# EAGLE board try1 (EAGLE 4.11)
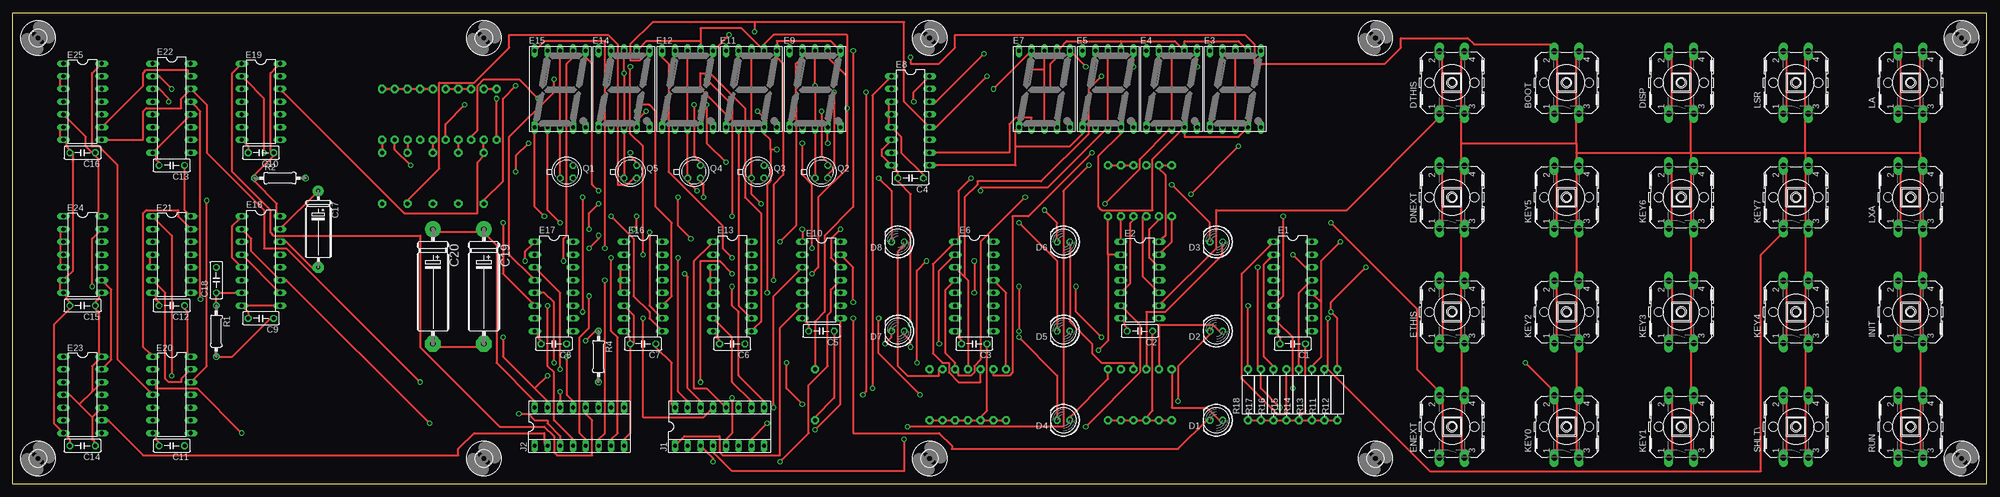
[diagram p4: board, top side]
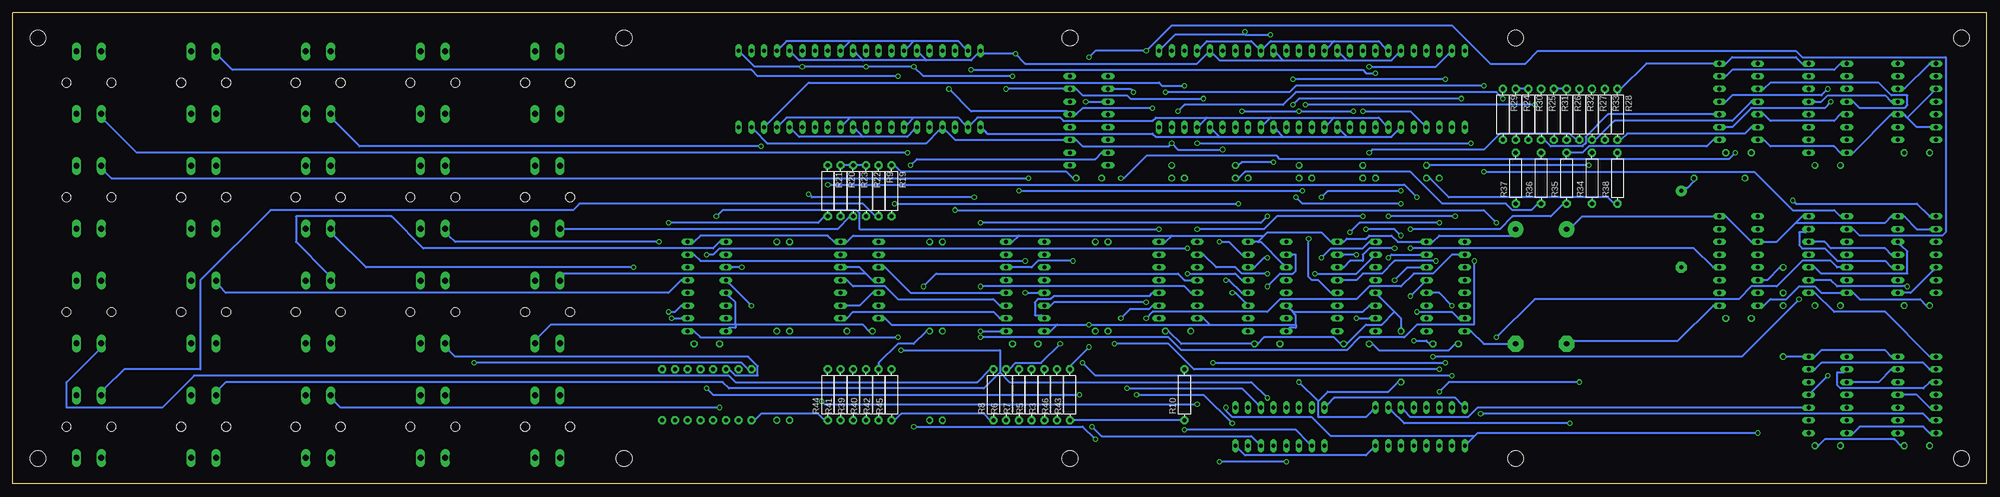
[diagram p5: board, bottom side, seen from below]

Size 393.7 x 93.98 mm. Coordinates in mm from the lower left corner, seen from the top.
Outline: 0,0 0,93.98 393.7,93.98 393.7,0 0,0
Copper layers (1*16): Top 0.035mm / dielectric 1.5mm / Bottom 0.035mm
Design rules "15mils": minimum track width 15mil, minimum drill 24mil, track to track 15mil, track to pad 10mil, pad to pad 10mil, via to via 10mil, smd to smd 10mil, copper to edge 25mil, drill to drill 10mil, minimum pad ring 10mil, minimum via ring 8mil, stop-mask expansion 0mil, vias tented up to drill 0mil, thermal gap 10mil

## Footprints (pad centres in the part's own frame; a part is rotated, then mirrored left to right if it is on the bottom)
B3F-40XX = drill 1.194 long: 1 -6.248,2.489; 2 6.248,2.489; 3 -6.248,-2.489; 4 6.248,-2.489 | hole 1.803: 0,-4.496; 0,4.496
C050-025X075 = drill 0.813 octagon: 1 -2.54,0; 2 2.54,0
E15-5 = drill 0.813 pad 2.159 round: + -7.62,0 | drill 0.813 pad 2.159 octagon: - 7.62,0
E22-6 = drill 1.016 pad 3.15 round: + -11.43,0 | drill 1.016 pad 3.15 octagon: - 11.43,0
LED5MM = drill 0.813 octagon: A -1.27,0; K 1.27,0
DIL16 = drill 0.813 long: 1 -8.89,-3.81; 2 -6.35,-3.81; 3 -3.81,-3.81; 4 -1.27,-3.81; 5 1.27,-3.81; 6 3.81,-3.81; 7 6.35,-3.81; 8 8.89,-3.81; 9 8.89,3.81; 10 6.35,3.81; 11 3.81,3.81; 12 1.27,3.81; 13 -1.27,3.81; 14 -3.81,3.81; 15 -6.35,3.81; 16 -8.89,3.81
DIL14 = drill 0.813 long: 1 -7.62,-3.81; 2 -5.08,-3.81; 3 -2.54,-3.81; 4 0,-3.81; 5 2.54,-3.81; 6 5.08,-3.81; 7 7.62,-3.81; 8 7.62,3.81; 9 5.08,3.81; 10 2.54,3.81; 11 0,3.81; 12 -2.54,3.81; 13 -5.08,3.81; 14 -7.62,3.81
HDSP-M = drill 0.813 long: 1 -5.08,-7.62; 2 -2.54,-7.62; 3 0,-7.62; 4 2.54,-7.62; 5 5.08,-7.62; 6 5.08,7.62; 7 2.54,7.62; 8 0,7.62; 9 -2.54,7.62; 10 -5.08,7.62
SOCKED-16 = drill 0.813 long: 1 -8.89,-3.81; 2 -6.35,-3.81; 3 -3.81,-3.81; 4 -1.27,-3.81; 5 1.27,-3.81; 6 3.81,-3.81; 7 6.35,-3.81; 8 8.89,-3.81; 9 8.89,3.81; 10 6.35,3.81; 11 3.81,3.81; 12 1.27,3.81; 13 -1.27,3.81; 14 -3.81,3.81; 15 -6.35,3.81; 16 -8.89,3.81
TO18 = drill 0.813 octagon: 1 -1.27,-1.27; 2 1.27,-1.27; 3 1.27,1.27
0207/10 = drill 0.813 octagon: 1 -5.08,0; 2 5.08,0
R-10 = drill 0.813 pad 1.6 octagon: 1 -5.08,0; 2 5.08,0
3,2 = hole 3.2: 0,0

## Placement (x,y rotation side)
BOOT  [B3F-40XX]  309.88,80.01 90 top
C1  0.01  [C050-025X075]  255.27,27.94 180 top
C2  0.01  [C050-025X075]  224.79,30.48 180 top
C3  0.01  [C050-025X075]  191.77,27.94 180 top
C4  0.01  [C050-025X075]  179.07,60.96 180 top
C5  0.01  [C050-025X075]  161.29,30.48 180 top
C6  0.01  [C050-025X075]  143.51,27.94 180 top
C7  0.01  [C050-025X075]  125.73,27.94 180 top
C8  0.01  [C050-025X075]  107.95,27.94 180 top
C9  0.01  [C050-025X075]  49.53,33.02 180 top
C10  0.01  [C050-025X075]  49.53,66.04 180 top
C11  0.01  [C050-025X075]  31.75,7.62 180 top
C12  0.01  [C050-025X075]  31.75,35.56 180 top
C13  0.01  [C050-025X075]  31.75,63.5 180 top
C14  0.01  [C050-025X075]  13.97,7.62 180 top
C15  0.01  [C050-025X075]  13.97,35.56 180 top
C16  0.01  [C050-025X075]  13.97,66.04 180 top
C17  1.0uf  [E15-5]  60.96,50.8 270 top
C18  82pf  [C050-025X075]  40.64,40.64 90 top
C19  6.8uf  [E22-6]  93.98,39.37 270 top
C20  6.8uf  [E22-6]  83.82,39.37 270 top
D1  MQ  [LED5MM]  240.03,12.7 180 top
D2  SR  [LED5MM]  240.03,30.48 180 top
D3  MD  [LED5MM]  240.03,48.26 180 top
D4  AC  [LED5MM]  209.55,12.7 180 top
D5  STATUS  [LED5MM]  209.55,30.48 180 top
D6  STATE  [LED5MM]  209.55,48.26 180 top
D7  BUS  [LED5MM]  176.53,30.48 180 top
D8  RUN  [LED5MM]  176.53,48.26 180 top
DISP  [B3F-40XX]  332.74,80.01 90 top
DNEXT  [B3F-40XX]  287.02,57.15 90 top
DTHIS  [B3F-40XX]  287.02,80.01 90 top
E1  74LS148N  [DIL16]  255.27,39.37 270 top
E2  74LS08N  [DIL14]  224.79,40.64 270 top
E3  HD-H101  [HDSP-M]  243.84,78.74 0 top
E4  HD-H101  [HDSP-M]  231.14,78.74 0 top
E5  HD-H101  [HDSP-M]  218.44,78.74 0 top
E6  74LS148N  [DIL16]  191.77,39.37 270 top
E7  HD-H101  [HDSP-M]  205.74,78.74 0 top
E8  7446N  [DIL16]  179.07,72.39 270 top
E9  HD-H101  [HDSP-M]  160.02,78.74 0 top
E10  74LS08N  [DIL14]  161.29,40.64 270 top
E11  HD-H101  [HDSP-M]  147.32,78.74 0 top
E12  HD-H101  [HDSP-M]  134.62,78.74 0 top
E13  7446N  [DIL16]  143.51,39.37 270 top
E14  HD-H101  [HDSP-M]  121.92,78.74 0 top
E15  HD-H101  [HDSP-M]  109.22,78.74 0 top
E16  7446N  [DIL16]  125.73,39.37 270 top
E17  74LS145N  [DIL16]  107.95,39.37 270 top
E18  74LS123N  [DIL16]  49.53,44.45 270 top
E19  7416N  [DIL14]  49.53,76.2 270 top
E20  74LS04N  [DIL14]  31.75,17.78 270 top
E21  74LS20N  [DIL14]  31.75,45.72 270 top
E22  74LS42N  [DIL16]  31.75,74.93 270 top
E23  74LS74N  [DIL14]  13.97,17.78 270 top
E24  74LS95N  [DIL14]  13.97,45.72 270 top
E25  74LS90N  [DIL14]  13.97,76.2 270 top
ENEXT  [B3F-40XX]  287.02,11.43 90 top
ETHIS  [B3F-40XX]  287.02,34.29 90 top
INIT  [B3F-40XX]  378.46,34.29 90 top
J1  [SOCKED-16]  140.97,11.43 0 top
J2  [SOCKED-16]  113.03,11.43 0 top
KEY0  [B3F-40XX]  309.88,11.43 90 top
KEY1  [B3F-40XX]  332.74,11.43 90 top
KEY2  [B3F-40XX]  309.88,34.29 90 top
KEY3  [B3F-40XX]  332.74,34.29 90 top
KEY4  [B3F-40XX]  355.6,34.29 90 top
KEY5  [B3F-40XX]  309.88,57.15 90 top
KEY6  [B3F-40XX]  332.74,57.15 90 top
KEY7  [B3F-40XX]  355.6,57.15 90 top
LA  [B3F-40XX]  378.46,80.01 90 top
LSR  [B3F-40XX]  355.6,80.01 90 top
LXA  [B3F-40XX]  378.46,57.15 90 top
Q1  2N2222A  [TO18]  110.49,62.23 0 top
Q2  2N2222A  [TO18]  161.29,62.23 0 top
Q3  2N2222A  [TO18]  148.59,62.23 0 top
Q4  2N2222A  [TO18]  135.89,62.23 0 top
Q5  2N2222A  [TO18]  123.19,62.23 0 top
R1  10K  [0207/10]  40.64,30.48 270 top
R2  6.8K  [0207/10]  53.34,60.96 0 top
R3  [R-10]  187.96,17.78 90 bottom
R4  10K  [0207/10]  116.84,25.4 270 top
R5  [R-10]  190.5,17.78 90 bottom
R6  [R-10]  195.58,17.78 90 bottom
R7  [R-10]  193.04,17.78 90 bottom
R8  [R-10]  198.12,17.78 90 bottom
R9  [R-10]  220.98,58.42 270 bottom
R10  [R-10]  160.02,17.78 90 bottom
R11  [R-10]  261.62,17.78 90 top
R12  [R-10]  264.16,17.78 90 top
R13  [R-10]  259.08,17.78 90 top
R14  [R-10]  256.54,17.78 90 top
R15  [R-10]  254,17.78 90 top
R16  [R-10]  251.46,17.78 90 top
R17  [R-10]  248.92,17.78 90 top
R18  [R-10]  246.38,17.78 90 top
R19  [R-10]  218.44,58.42 270 bottom
R20  [R-10]  228.6,58.42 270 bottom
R21  [R-10]  231.14,58.42 270 bottom
R22  [R-10]  223.52,58.42 270 bottom
R23  [R-10]  226.06,58.42 270 bottom
R24  [R-10]  93.98,73.66 270 bottom
R25  [R-10]  88.9,73.66 270 bottom
R26  [R-10]  83.82,73.66 270 bottom
R27  [R-10]  78.74,73.66 270 bottom
R28  [R-10]  73.66,73.66 270 bottom
R29  [R-10]  96.52,73.66 270 bottom
R30  [R-10]  91.44,73.66 270 bottom
R31  [R-10]  86.36,73.66 270 bottom
R32  [R-10]  81.28,73.66 270 bottom
R33  [R-10]  76.2,73.66 270 bottom
R34  [R-10]  78.74,60.96 90 bottom
R35  [R-10]  83.82,60.96 90 bottom
R36  [R-10]  88.9,60.96 90 bottom
R37  [R-10]  93.98,60.96 90 bottom
R38  [R-10]  73.66,60.96 90 bottom
R39  [R-10]  226.06,17.78 90 bottom
R40  [R-10]  223.52,17.78 90 bottom
R41  [R-10]  228.6,17.78 90 bottom
R42  [R-10]  220.98,17.78 90 bottom
R43  [R-10]  182.88,17.78 90 bottom
R44  [R-10]  231.14,17.78 90 bottom
R45  [R-10]  218.44,17.78 90 bottom
R46  [R-10]  185.42,17.78 90 bottom
RUN  [B3F-40XX]  378.46,11.43 90 top
SHLT\  [B3F-40XX]  355.6,11.43 90 top
U$1  [3,2]  5.08,5.08 0 top
U$2  [3,2]  5.08,88.9 0 top
U$3  [3,2]  388.62,88.9 0 top
U$4  [3,2]  388.62,5.08 0 top
U$5  [3,2]  93.98,88.9 0 top
U$6  [3,2]  182.88,5.08 0 top
U$7  [3,2]  93.98,5.08 0 top
U$8  [3,2]  271.78,5.08 0 top
U$9  [3,2]  271.78,88.9 0 top
U$10  [3,2]  182.88,88.9 0 top

## Tracks (layer width: path | path; a pad name or v marks a point on that pad's centre or on a via)
A  (via drill 0.61)
  Top 0.381: 220.98,88.27 210.19,88.27 208.91,87 E7.7 208.28,85.09 207.01,83.82 v207.01,78.74 | 220.98,88.27 220.98,87.63 E5.7 | 220.98,88.27 231.78,88.27 233.04,87 E4.7 233.68,87.63 233.68,88.27 244.47,88.27 245.75,87 E3.7 | 137.16,88.27 126.36,88.27 125.09,87 E14.7 | 137.16,88.27 137.16,87.63 E12.7 | 137.16,88.27 137.16,90.81 145.41,90.81 149.22,87 E11.7 149.86,87.63 151.76,89.53 166.37,89.53 166.37,81.28 | v159.38,41.91 160.66,43.18 160.66,57.15 166.37,62.87 v166.37,74.93 166.37,81.28 | 166.37,81.28 162.56,85.09 E9.7
  Bottom 0.381: v159.38,41.91 149.86,41.91 148.59,40.64 E13.13 | v166.37,74.93 180.34,74.93 181.61,73.66 E8.13 183.51,74.3 202.56,74.3 v207.01,78.74
ADDR0
  Top 0.381: J1.10 147.32,16.51 143.51,20.32 143.51,29.21 140.34,32.38 E13.7
ADDR1
  Top 0.381: J1.12 141.6,15.88 138.43,19.05 135.89,19.05 135.89,44.45 139.06,47.62 E13.1
ADDR2  (via drill 0.61)
  Top 0.381: v143.51,39.37 143.51,35.56 144.78,34.29 144.78,21.59 149.86,16.51 J1.9
  Bottom 0.381: v143.51,39.37 140.97,41.91 138.43,41.91 137.79,42.55 137.79,45.72 138.43,45.72 E13.2
B  (via drill 0.61)
  Top 0.381: v142.88,89.53 140.34,87 E12.6 | v151.76,40.64 151.76,59.69 153.67,61.59 153.67,83.82 152.4,85.09 E11.6 152.4,87.63 152.4,88.27 163.19,88.27 164.47,87 E9.6 | v214,83.19 211.46,85.72 E7.6 | v223.52,83.19 223.52,85.09 E5.6 | v236.22,83.19 236.22,85.09 E4.6 | 147.96,92.08 177.8,92.08 177.8,76.2 182.25,71.75 E8.12 184.15,71.12 v194.31,81.28 | 147.96,92.08 127.64,92.08 123.19,87.63 123.19,84.45 125.09,84.45 126.36,85.72 E14.6 | 147.96,92.08 v147.96,90.17
  Bottom 0.381: 147.96,89.53 161.93,89.53 164.47,87 E9.6 | 147.96,89.53 v142.88,89.53 | v151.76,40.64 151.13,40.64 148.59,38.1 E13.12 | E3.6 248.28,85.72 245.75,83.19 v236.22,83.19 v223.52,83.19 v214,83.19 212.09,81.28 v194.31,81.28 | v147.96,90.17 147.96,89.53
BEMA0  (via drill 0.61)
  Top 0.381: v125.73,33.02 125.73,13.34 137.79,13.34 139.06,14.61 J1.13
  Bottom 0.381: v125.73,33.02 123.19,33.02 E16.7
BEMA1  (via drill 0.61)
  Top 0.381: v132.72,45.09 132.72,18.41 134.62,16.51 J1.15
  Bottom 0.381: v132.72,45.09 130.81,46.99 124.46,46.99 123.19,48.26 E16.1
BEMA2  (via drill 0.61)
  Top 0.381: v133.99,41.91 134.62,41.27 134.62,19.05 137.16,16.51 J1.14
  Bottom 0.381: v133.99,41.91 125.73,41.91 122.56,45.09 E16.2
BOOT  (via drill 0.61)
  Top 0.381: BOOT.1 307.98,74.93 307.98,85.09 BOOT.2 306.7,87.63 291.46,87.63 290.19,88.9 276.86,88.9 276.86,87 273.69,83.82 247.65,83.82 247.65,87.63 245.75,89.53 187.96,89.53 187.96,87 184.78,83.82 179.07,83.82 v179.07,85.09 | v167.64,86.36 167.64,55.24 161.93,49.53 161.93,34.29 160.02,32.38 160.02,23.5 R10.2
  Bottom 0.381: E21.2 26.67,50.8 25.4,49.53 8.89,49.53 8.26,50.16 8.26,85.09 36.83,85.09 38.1,86.36 89.53,86.36 92.08,83.82 99.06,83.82 106.68,91.44 162.56,91.44 v167.64,86.36 177.8,86.36 v179.07,85.09
BPWR-OK  (via drill 0.61)
  Top 0.381: E18.2 46.35,50.16 47.62,48.9 47.62,46.35 52.7,41.27 E18.11 54.61,40.64 v83.19,12.06
  Bottom 0.381: v83.19,12.06 116.2,12.06 118.75,14.61 J2.10
BRUN
  Top 0.381: E19.1 45.09,83.19 43.81,81.92 43.81,62.23 51.44,54.61 51.44,50.16 52.07,49.53 81.28,49.53 81.28,27.3 97.16,11.43 106.05,11.43 107.95,9.53 107.95,6.35 108.58,5.71 115.57,5.71 115.57,12.7 114.3,13.97 J2.12
C  (via drill 0.61)
  Top 0.381: v126.36,74.3 124.46,72.39 E14.4 | v137.16,74.3 137.16,72.39 E12.4 | v150.5,38.1 150.5,59.69 151.13,60.33 151.13,66.67 | 151.13,66.67 151.13,68.58 149.86,69.85 E11.4 149.86,72.39 149.86,73.03 v148.59,74.3 | E5.4 220.98,69.85 216.53,65.41 216.53,55.24 217.17,54.61 227.33,54.61 227.33,64.77 233.04,70.48 E4.4 233.68,69.85 233.68,69.22 244.47,69.22 245.75,70.48 E3.4 | v162.56,67.94 162.56,69.85 E9.4 | v152.4,66.67 151.13,66.67
  Bottom 0.381: v126.36,74.3 v137.16,74.3 v148.59,74.3 | v150.5,38.1 149.86,38.1 147.96,36.2 E13.11 | E3.4 245.75,70.48 243.21,67.94 211.46,67.94 208.91,70.48 E7.4 207.65,70.48 205.74,68.58 184.15,68.58 E8.11 181.61,68.58 180.34,67.31 163.19,67.31 v162.56,67.94 161.29,66.67 v152.4,66.67
D
  Top 0.381: E8.10 184.15,66.04 198.75,66.04 198.75,71.75 200.03,73.03 203.2,73.03 203.2,72.39 E7.2 | E13.10 146.69,33.66 144.78,35.56 144.78,69.85 E11.2
  Bottom 0.381: 214,73.03 215.26,71.75 E5.2 | 214,73.03 205.1,73.03 203.84,71.75 E7.2 202.56,71.75 201.29,73.03 184.78,73.03 184.15,72.39 166.37,72.39 165.74,73.03 155.57,73.03 | 226.69,73.03 227.97,71.75 E4.2 | 214,73.03 226.69,73.03 | 226.69,73.03 239.4,73.03 240.66,71.75 E3.2 | 130.18,73.03 121.28,73.03 120.02,71.75 E14.2 | 130.18,73.03 131.44,71.75 E12.2 | 142.88,73.03 144.15,71.75 E11.2 | 142.88,73.03 130.18,73.03 | 155.57,73.03 156.84,71.75 E9.2 | 155.57,73.03 142.88,73.03
DISP  (via drill 0.61)
  Top 0.381: DISP.1 330.83,74.93 330.83,85.09 DISP.2 | E6.4 187.32,40.01 186.06,38.73 186.06,26.04 187.96,24.13 187.96,23.5 R3.2 188.59,22.86 188.59,21.59 191.13,21.59 191.77,22.23 191.77,23.5 193.04,24.77 193.04,48.26 v201.93,57.15 | v234.95,57.78 v244.47,67.31
  Bottom 0.381: v244.47,67.31 324.49,67.31 329.56,72.39 DISP.1 | v234.95,57.78 234.31,57.15 v201.93,57.15
DISP0  (via drill 0.61)
  Top 0.381: v114.94,37.47 114.94,31.11 113.03,29.21 113.03,10.16 114.3,8.89 J2.5
  Bottom 0.381: v114.94,37.47 112.39,40.01 E17.13
DISP1  (via drill 0.61)
  Top 0.381: v118.11,40.64 118.11,10.16 116.84,8.89 J2.6
  Bottom 0.381: v118.11,40.64 115.57,43.18 113.03,43.18 E17.14
DISP2  (via drill 0.61)
  Top 0.381: v119.38,45.09 119.38,30.48 120.65,29.21 120.65,10.16 119.38,8.89 J2.7
  Bottom 0.381: v119.38,45.09 118.75,45.72 113.03,45.72 E17.15
DISPINH  (via drill 0.61)
  Top 0.381: v106.68,35.56 106.68,23.5 107.95,22.23 107.95,12.7 111.76,8.89 J2.4
  Bottom 0.381: v106.68,35.56 109.22,38.1 110.49,38.1 E17.12
DISPLAY0  (via drill 0.61)
  Top 0.381: v178.44,11.43 209.55,11.43 209.55,58.42 v214.63,63.5
  Bottom 0.381: v178.44,11.43 176.53,9.53 146.69,9.53 145.41,8.26 J1.6 | v214.63,63.5 213.36,64.77 177.8,64.77 176.53,66.04 E8.7
DISPLAY1  (via drill 0.61)
  Top 0.381: v171.45,19.05 171.45,77.47 174.62,80.64 E8.1
  Bottom 0.381: v171.45,19.05 148.59,19.05 145.41,15.88 J1.11
DISPLAY2  (via drill 0.61)
  Top 0.381: v150.5,12.06 147.32,8.89 J1.7 | v169.54,17.78 170.18,18.41 v170.18,78.11
  Bottom 0.381: v150.5,12.06 156.21,17.78 v169.54,17.78 | v170.18,78.11 170.81,78.74 173.99,78.74 E8.2
DNEXT
  Top 0.381: DNEXT.1 285.12,52.07 285.12,62.23 DNEXT.2 | E2.10 227.97,38.73 225.43,41.27 225.43,53.34 R23.2
  Bottom 0.381: DNEXT.1 283.85,50.8 229.24,50.8 226.69,53.34 R23.2
DTHIS
  Top 0.381: DTHIS.2 285.12,85.09 285.12,74.93 DTHIS.1 283.85,72.39 266.06,54.61 240.03,54.61 240.03,46.99 229.24,36.2 E2.9 | R22.2 223.52,52.7 222.88,52.07 222.88,40.01 221.62,38.73 E2.5
  Bottom 0.381: E2.5 222.25,38.1 224.79,35.56 227.33,35.56 E2.9
E
  Top 0.381: 200.03,67.31 200.03,70.48 E7.1 | 200.03,67.31 200.03,63.5 184.15,63.5 E8.9 | 200.03,67.31 210.82,67.31 213.36,69.85 E5.1 | E13.9 147.96,31.11 149.22,32.38 149.22,53.98 146.05,57.15 146.05,74.93 139.06,81.92 137.16,81.92 137.16,78.74 142.24,73.66 142.24,72.39 E11.1
  Bottom 0.381: 224.16,69.22 215.26,69.22 214,70.48 E5.1 | 224.16,69.22 225.43,70.48 E4.1 | 224.16,69.22 236.85,69.22 238.12,70.48 E3.1 | 127.64,69.22 118.75,69.22 117.47,70.48 E14.1 | 127.64,69.22 128.91,70.48 E12.1 | 140.34,69.22 141.6,70.48 E11.1 | 140.34,69.22 127.64,69.22 | 153.03,69.22 154.31,70.48 E9.1 | 153.03,69.22 140.34,69.22 | 153.03,69.22 165.74,69.22 166.37,69.85 199.39,69.85 200.03,70.48 E7.1
ENEXT  (via drill 0.61)
  Top 0.381: E2.13 229.24,46.35 231.14,48.26 231.14,52.7 R21.2 | ENEXT.1 285.12,6.35 285.12,16.51 ENEXT.2 283.85,19.05 280.04,22.86 280.04,34.92 v262.89,52.07
  Bottom 0.381: v262.89,52.07 233.04,52.07 231.78,53.34 R21.2
ETHIS
  Top 0.381: ETHIS.1 285.12,29.21 285.12,39.37 ETHIS.2 | R20.2 228.6,52.7 226.69,50.8 226.69,45.09 227.97,43.81 E2.12
  Bottom 0.381: 223.52,41.91 224.79,43.18 227.33,43.18 E2.12 | 223.52,41.91 222.25,40.64 E2.4 | 223.52,41.91 283.85,41.91 ETHIS.2
EXTPUL\  (via drill 0.61)
  Top 0.381: v143.51,41.91 140.97,44.45 137.16,44.45 v137.16,20.32
  Bottom 0.381: 133.35,16.51 131.44,18.41 119.38,18.41 117.47,20.32 R4.2 | 133.35,16.51 133.35,13.34 123.83,13.34 122.56,14.61 J2.9 | v143.51,41.91 148.59,41.91 149.86,43.18 153.67,43.18 156.21,45.72 E10.2 | 133.35,16.51 v137.16,20.32
F  (via drill 0.61)
  Top 0.381: v195.58,78.74 202.56,85.72 E7.9 | v153.03,48.26 156.21,51.44 v156.21,76.83 156.21,83.82 157.48,85.09 E9.9
  Bottom 0.381: v195.58,78.74 184.15,78.74 E8.15 181.61,78.74 180.34,77.47 171.45,77.47 170.81,76.83 v156.21,76.83 | 214,88.27 215.26,87 E5.9 | 214,88.27 205.1,88.27 203.84,87 E7.9 | 226.69,88.27 227.97,87 E4.9 | 214,88.27 226.69,88.27 | 226.69,88.27 239.4,88.27 240.66,87 E3.9 | 130.18,88.27 121.28,88.27 120.02,87 E14.9 | 130.18,88.27 131.44,87 E12.9 | 130.18,88.27 142.88,88.27 144.15,87 E11.9 145.41,87 146.69,88.27 155.57,88.27 156.84,87 E9.9 | v153.03,48.26 151.13,48.26 148.59,45.72 E13.15
FUN\  (via drill 0.61)
  Top 0.381: E21.5 27.3,43.81 27.3,45.09 E21.4 | 104.14,19.05 97.79,25.4 v97.79,29.21 | 104.14,19.05 106.68,16.51 J2.15 | v182.25,44.45 180.34,42.55 v180.34,24.13 | 104.14,19.05 v106.68,21.59
  Bottom 0.381: v97.79,29.21 90.17,36.83 49.53,36.83 46.99,39.37 41.91,39.37 36.83,44.45 31.11,44.45 29.84,43.18 29.21,43.18 E21.5 | v182.25,44.45 189.23,44.45 190.5,43.18 194.31,43.18 E6.14 | v180.34,24.13 177.8,21.59 v106.68,21.59
G  (via drill 0.61)
  Top 0.381: v193.68,85.72 184.15,76.2 E8.14 | v143.51,45.09 141.6,46.99 141.6,51.44 130.81,62.23 130.81,83.82 129.54,85.09 E12.10
  Bottom 0.381: 211.46,84.45 212.72,85.72 E5.10 | 211.46,84.45 202.56,84.45 201.29,85.72 E7.10 200.03,85.72 v193.68,85.72 191.77,83.82 157.48,83.82 155.57,85.72 E9.10 154.31,85.72 153.03,84.45 140.34,84.45 | 224.16,84.45 225.43,85.72 E4.10 | 211.46,84.45 224.16,84.45 | 224.16,84.45 236.85,84.45 238.12,85.72 E3.10 | 127.64,84.45 118.75,84.45 117.47,85.72 E14.10 | 127.64,84.45 128.91,85.72 E12.10 | 140.34,84.45 141.6,85.72 E11.10 | 140.34,84.45 127.64,84.45 | v143.51,45.09 144.15,45.09 146.05,43.18 E13.14
GND  (via drill 0.61)
  Top 0.381: 380.37,66.04 380.37,72.39 LA.3 380.37,74.93 380.37,85.09 LA.4 | 380.37,66.04 380.37,64.77 LXA.4 380.37,62.23 380.37,52.07 LXA.3 380.37,49.53 380.37,41.91 INIT.4 380.37,39.37 380.37,29.21 INIT.3 380.37,26.67 380.37,19.05 RUN.4 380.37,16.51 380.37,6.35 RUN.3 | 357.5,66.04 357.5,72.39 LSR.3 357.5,74.93 357.5,85.09 LSR.4 | 357.5,66.04 357.5,64.77 KEY7.4 357.5,62.23 357.5,52.07 KEY7.3 357.5,49.53 357.5,41.91 KEY4.4 357.5,39.37 357.5,29.21 KEY4.3 357.5,26.67 357.5,19.05 SHLT\.4 357.5,16.51 357.5,6.35 SHLT\.3 | 334.64,66.04 334.64,72.39 DISP.3 334.64,74.93 334.64,85.09 DISP.4 | 334.64,66.04 334.64,64.77 KEY6.4 334.64,62.23 334.64,52.07 KEY6.3 334.64,49.53 334.64,41.91 KEY3.4 334.64,39.37 334.64,29.21 KEY3.3 334.64,26.67 334.64,19.05 KEY1.4 334.64,16.51 334.64,6.35 KEY1.3 | 288.93,67.94 288.93,72.39 DTHIS.3 288.93,74.93 288.93,85.09 DTHIS.4 | 288.93,67.94 288.93,64.77 DNEXT.4 288.93,62.23 288.93,52.07 DNEXT.3 288.93,49.53 288.93,41.91 ETHIS.4 288.93,39.37 288.93,29.21 ETHIS.3 288.93,26.67 288.93,19.05 ENEXT.4 288.93,16.51 288.93,6.35 ENEXT.3 | 311.79,67.94 311.79,72.39 BOOT.3 311.79,74.93 311.79,85.09 BOOT.4 | 311.79,67.94 311.79,66.04 | 311.79,66.04 311.79,64.77 KEY5.4 311.79,62.23 311.79,52.07 KEY5.3 311.79,49.53 311.79,41.91 KEY2.4 311.79,39.37 311.79,29.21 KEY2.3 311.79,26.67 311.79,19.05 KEY0.4 311.79,16.51 311.79,6.35 KEY0.3 | 288.93,67.94 311.79,67.94 | 311.79,66.04 334.64,66.04 | 334.64,66.04 357.5,66.04 | 357.5,66.04 380.37,66.04 | C14.2 11.43,8.26 11.43,8.89 10.79,9.53 E23.7 9.53,10.79 8.26,12.06 8.26,31.75 11.43,34.92 C15.2 11.43,36.2 10.79,36.83 10.79,37.47 E24.7 9.53,38.73 9.53,40.01 E24.6 10.79,41.27 12.06,42.55 12.06,66.04 C16.2 11.43,66.67 10.79,67.31 10.79,67.94 E25.7 9.53,69.22 9.53,70.48 E25.6
  Top 0.381: C11.2 29.21,8.26 28.57,8.89 28.57,9.53 E20.7 | C12.2 29.21,36.2 28.57,36.83 28.57,37.47 E21.7 | E25.3 9.53,79.38 9.53,80.64 E25.2 | E19.7 46.35,67.94 46.99,67.31 46.99,66.67 C10.2 | C13.2 29.21,64.14 28.57,64.77 28.57,65.41 E22.8 28.57,66.67 34.92,73.03 E22.12 | C8.2 105.41,28.57 104.78,29.21 104.78,29.84 E17.8 | C9.2 46.99,33.66 46.99,34.29 46.35,34.92 E18.8 46.99,35.56 52.07,35.56 E18.9 | C19.- 92.71,27.3 85.09,27.3 C20.- | J2.8 121.92,8.89 123.19,10.16 123.19,27.3 C7.2 | E16.8 122.56,29.84 123.19,29.21 123.19,28.57 C7.2 | E16.6 122.56,34.92 123.83,33.66 123.83,27.94 C7.2 | C2.2 222.25,31.11 221.62,31.75 221.62,32.38 E2.7 | E1.8 252.09,29.84 252.73,29.21 252.73,28.57 C1.2 | E8.6 174.62,67.94 173.35,66.67 173.35,65.41 174.62,64.14 E8.8 175.9,62.87 176.53,62.23 176.53,61.59 C4.2 176.53,60.33 179.07,57.78 v179.07,31.75 | C3.2 189.23,28.57 188.59,29.21 188.59,29.84 E6.8 | E10.7 158.12,32.38 158.75,31.75 158.75,31.11 C5.2 | C6.2 140.97,28.57 140.34,29.21 140.34,29.84 E13.8
  Bottom 0.381: E23.7 11.43,10.16 12.7,11.43 25.4,11.43 26.67,10.16 E20.7 | C15.2 12.06,35.56 13.34,36.83 25.4,36.83 26.67,38.1 E21.7 29.21,38.1 33.02,38.1 34.29,39.37 37.47,39.37 40.01,36.83 43.18,36.83 44.45,35.56 E18.8 | 15.88,73.03 13.97,71.12 11.43,71.12 E25.6 | 15.88,73.03 16.51,73.66 E25.10 19.05,73.66 26.67,66.04 E22.8 29.21,66.04 30.48,67.31 43.18,67.31 44.45,68.58 E19.7 | 15.88,73.03 10.79,78.11 E25.3 | E17.8 102.87,30.48 100.33,27.94 95.25,27.94 C19.- | E18.9 54.61,35.56 61.59,28.57 82.55,28.57 C20.- | J1.8 149.22,6.99 147.96,5.71 123.83,5.71 122.56,6.99 J2.8 | 249.56,31.75 249.56,31.11 250.82,31.11 E1.8 | 249.56,31.75 249.56,36.2 250.82,37.47 E1.5 | 249.56,31.75 224.16,31.75 222.88,30.48 C2.2 | 138.43,34.29 137.79,33.66 137.79,31.75 | 138.43,34.29 139.06,34.92 E13.6 | 137.79,31.75 137.79,31.11 139.06,31.11 E13.8 | 154.94,31.75 156.21,33.02 E10.7 | 154.94,31.75 137.79,31.75 | 185.42,31.75 186.69,30.48 E6.8 | 154.94,31.75 v179.07,31.75 185.42,31.75 | 185.42,31.75 218.44,31.75 219.71,33.02 E2.7 | 138.43,34.29 124.46,34.29 123.19,35.56 E16.6 | C8.2 106.05,27.94 107.31,26.67 121.28,26.67 122.56,27.94 C7.2 | 249.56,31.75 286.38,31.75 288.93,29.21 ETHIS.3
INIT
  Top 0.381: INIT.1 376.56,29.21 376.56,39.37 INIT.2 | E6.13 196.22,40.01 198.12,38.1 198.12,23.5 R8.2
  Bottom 0.381: INIT.1 376.56,26.67 382.9,20.32 382.9,15.24 363.86,15.24 357.5,21.59 250.82,21.59 249.56,20.32 201.29,20.32 198.75,22.86 R8.2
KE-F\  (via drill 0.61)
  Top 0.381: v100.97,13.97 102.87,13.97 104.14,12.7 106.68,12.7 106.68,12.06 109.22,9.53 109.22,8.89 J2.3
  Bottom 0.381: v100.97,13.97 12.7,13.97 11.43,12.7 E23.6
KEY0  (via drill 0.61)
  Top 0.381: KEY0.1 307.98,6.35 307.98,16.51 KEY0.2 306.7,19.05 v301.62,24.13 | v246.38,35.56 246.38,23.5 R18.2
  Bottom 0.381: v246.38,35.56 250.82,40.01 E1.4 | v301.62,24.13 248.28,24.13 247.01,22.86 R18.2
KEY1  (via drill 0.61)
  Top 0.381: KEY1.1 330.83,6.35 330.83,16.51 KEY1.2 | v248.28,43.18 248.28,22.86 R17.2 248.92,22.23 248.92,19.05 v252.73,15.24
  Bottom 0.381: v248.28,43.18 250.19,43.18 E1.3 | v252.73,15.24 328.3,15.24 329.56,16.51 KEY1.2
KEY2
  Top 0.381: KEY2.1 307.98,29.21 307.98,39.37 KEY2.2 | E1.2 250.82,45.09 249.56,43.81 249.56,25.4 251.46,23.5 R16.2
  Bottom 0.381: KEY2.1 306.7,26.67 305.44,25.4 247.01,25.4 245.11,23.5 245.11,21.59 249.56,21.59 250.82,22.86 R16.2
KEY3
  Top 0.381: KEY3.1 330.83,29.21 330.83,39.37 KEY3.2 | E1.1 250.82,47.62 245.11,41.91 245.11,20.95 252.09,13.97 254,13.97 254,22.23 R15.2
  Bottom 0.381: KEY3.2 330.83,41.91 337.19,48.26 337.19,53.34 318.13,53.34 311.79,46.99 254,46.99 252.73,48.26 E1.1
KEY4
  Top 0.381: KEY4.1 353.69,29.21 353.69,39.37 KEY4.2 | E1.13 258.44,40.01 256.54,38.1 256.54,23.5 R14.2
  Bottom 0.381: KEY4.2 352.43,39.37 351.15,38.1 262.89,38.1 260.35,40.64 E1.13
KEY5  (via drill 0.61)
  Top 0.381: KEY5.1 307.98,52.07 307.98,62.23 KEY5.2 | 260.99,36.2 259.71,37.47 E1.12 | 260.99,36.2 260.99,25.4 259.08,23.5 R13.2 | v264.8,48.26 260.99,44.45 260.99,36.2
  Bottom 0.381: v264.8,48.26 305.44,48.26 306.7,49.53 KEY5.1
KEY6  (via drill 0.61)
  Top 0.381: KEY6.1 330.83,52.07 330.83,62.23 KEY6.2 | R12.2 264.16,23.5 264.16,33.02 v262.89,34.29 262.89,36.2 v269.88,43.18
  Bottom 0.381: v262.89,34.29 261.62,34.29 260.35,35.56 E1.11 | v269.88,43.18 323.21,43.18 329.56,49.53 KEY6.1
KEY7  (via drill 0.61)
  Top 0.381: 262.25,22.86 v262.25,33.02 | 262.25,22.86 R11.2 262.25,22.86 | KEY7.2 353.69,62.23 353.69,52.07 KEY7.1 352.43,49.53 348.62,45.72 348.62,2.54 282.57,2.54 262.25,22.86
  Bottom 0.381: v262.25,33.02 260.35,33.02 E1.10
KEYSTB
  Top 0.381: E23.9 19.05,12.7 26.04,5.71 88.9,5.71 88.9,6.99 92.08,10.16 106.05,10.16 106.05,8.26 J2.2
KFUN0\  (via drill 0.61)
  Top 0.381: v139.7,4.45 139.7,5.08 137.79,6.99 J1.3 | v153.03,4.45 158.75,10.16 158.75,19.68 162.56,23.5 162.56,33.66 163.19,34.29 163.19,38.73 164.47,40.01 E10.11
  Bottom 0.381: v139.7,4.45 v153.03,4.45
KFUN1\  (via drill 0.61)
  Top 0.381: v160.02,10.79 165.1,15.88 165.1,32.38 E10.8
  Bottom 0.381: v160.02,10.79 137.79,10.79 135.25,8.26 J1.2
KFUN2\
  Top 0.381: J1.1 132.72,8.26 133.99,9.53 140.97,9.53 140.97,6.35 141.6,5.71 153.03,5.71 153.03,31.11 156.84,34.92 E10.6
LA  (via drill 0.61)
  Top 0.381: LA.1 376.56,74.93 376.56,85.09 LA.2 | v184.78,27.94 184.78,42.55 187.32,45.09 E6.2 | v215.26,66.04 202.56,53.34 199.39,53.34 199.39,22.23 198.75,21.59 195.58,21.59 195.58,22.23 R6.2
  Bottom 0.381: v184.78,27.94 188.59,24.13 193.68,24.13 194.94,22.86 R6.2 | v215.26,66.04 368.94,66.04 375.29,72.39 LA.1
LSR  (via drill 0.61)
  Top 0.381: LSR.1 353.69,74.93 353.69,85.09 LSR.2 | 189.87,41.27 190.5,40.64 190.5,23.5 R5.2 | 189.87,41.27 188.59,42.55 E6.3 | v217.17,81.28 214.63,78.74 214.63,69.85 205.1,60.33 192.41,60.33 192.41,59.69 189.87,57.15 189.87,41.27
  Bottom 0.381: v217.17,81.28 245.11,81.28 246.38,82.55 349.88,82.55 352.43,85.09 LSR.2
LXA  (via drill 0.61)
  Top 0.381: LXA.1 376.56,52.07 376.56,62.23 LXA.2 | R7.2 193.04,22.23 193.04,20.32 188.59,20.32 186.69,22.23 186.69,24.13 185.42,24.13 183.51,26.04 183.51,43.81 187.32,47.62 E6.1 188.59,48.9 188.59,58.42 v191.13,60.96
  Bottom 0.381: v191.13,60.96 374.01,60.96 375.29,62.23 LXA.2
MCLOCK
  Top 0.381: E20.4 27.3,18.41 20.95,24.77 20.95,63.5 17.14,67.31 15.88,67.31 15.88,81.92 17.14,83.19 E25.14
MCLOCK\  (via drill 0.61)
  Top 0.381: E24.9 18.41,40.01 19.68,38.73 19.68,24.77 18.41,23.5 E23.13 | v45.72,10.16 36.83,19.05 28.57,19.05 28.57,19.68 E20.3 | v151.76,15.24 151.76,37.47 156.84,42.55 E10.3
  Bottom 0.381: E23.13 19.05,22.86 21.59,20.32 26.67,20.32 E20.3 | 102.23,9.53 101.6,10.16 v45.72,10.16 | 102.23,9.53 103.5,8.26 J2.1 | v151.76,15.24 151.76,14.61 150.5,13.34 134.62,13.34 130.81,9.53 102.23,9.53
MPXA  (via drill 0.61)
  Top 0.381: E25.8 19.05,68.58 26.04,68.58 26.04,74.3 26.67,74.93 33.66,74.93 33.66,76.83 34.92,78.11 E22.14 36.2,78.11 38.73,75.56 38.73,66.04 50.16,54.61 50.16,46.99 54.61,46.99 v81.28,20.32 | v109.22,18.41 109.22,16.51 J2.14
  Bottom 0.381: v109.22,18.41 107.31,20.32 v81.28,20.32
MPXB  (via drill 0.61)
  Top 0.381: v110.49,25.4 110.49,17.78 111.76,16.51 J2.13 | v37.47,36.83 37.47,74.3 36.2,75.56 E22.13
  Bottom 0.381: E25.11 19.05,76.2 20.32,77.47 31.75,77.47 33.02,76.2 34.29,76.2 E22.13 | v110.49,25.4 48.9,25.4 v37.47,36.83
N$1  (via drill 0.61)
  Top 0.381: v253.37,53.34 253.37,37.47 252.09,36.2 E1.6 | v165.1,50.8 163.19,48.9 163.19,45.09 164.47,43.81 E10.12
  Bottom 0.381: v253.37,53.34 252.09,54.61 225.43,54.61 224.79,53.98 224.79,50.8 v165.1,50.8
N$2  (via drill 0.61)
  Top 0.381: v255.27,19.05 255.27,29.21 252.09,32.38 E1.7 | v180.97,17.78 172.72,26.04 v172.72,33.02
  Bottom 0.381: v255.27,19.05 254,17.78 v180.97,17.78 | v172.72,33.02 170.81,34.92 167,34.92 166.37,35.56 E10.9
N$3  (via drill 0.61)
  Top 0.381: v217.17,29.21 212.09,34.29 v212.09,39.37
  Bottom 0.381: v217.17,29.21 256.54,29.21 257.81,30.48 E1.9 | v212.09,39.37 209.55,41.91 161.29,41.91 160.02,40.64 158.75,40.64 E10.4
N$4  (via drill 0.61)
  Top 0.381: v31.75,21.59 31.75,49.53 28.57,52.7 E21.1 | v255.27,45.72 257.81,43.18 E1.14 | v159.38,46.99 159.38,59.69 157.48,61.59 v157.48,67.94 | v102.87,67.94 100.33,65.41 v100.33,62.23
  Bottom 0.381: v31.75,21.59 34.92,18.41 E20.11 | v255.27,45.72 254,45.72 252.73,46.99 v159.38,46.99 | v157.48,67.94 v102.87,67.94 | v100.33,62.23 46.35,62.23 38.73,54.61 30.48,54.61 29.21,53.34 E21.1
N$5  (via drill 0.61)
  Top 0.381: v167.64,36.2 167.64,43.18 165.74,45.09 E10.13
  Bottom 0.381: v167.64,36.2 186.06,36.2 186.69,35.56 E6.6
N$6
  Bottom 0.381: E10.10 166.37,38.1 167,37.47 186.06,37.47 186.69,36.83 189.23,36.83 189.87,36.2 189.87,33.66 188.59,33.66 E6.7
N$7  (via drill 0.61)
  Top 0.381: v200.66,39.37 v200.66,30.48
  Bottom 0.381: v200.66,39.37 160.02,39.37 158.75,38.1 E10.5 | v200.66,30.48 196.85,30.48 E6.9
N$8  (via drill 0.61)
  Top 0.381: v191.77,44.45 v191.77,38.1
  Bottom 0.381: v191.77,38.1 189.23,38.1 E6.5 | v191.77,44.45 256.54,44.45 257.81,45.72 E1.15
N$9  (via drill 0.61)
  Top 0.381: v15.88,39.37 15.88,48.9 17.14,50.16 E24.13
  Bottom 0.381: v15.88,39.37 29.84,39.37 31.11,40.64 34.29,40.64 E21.9
N$10
  Bottom 0.381: E24.12 17.14,47.62 15.88,46.35 15.88,41.91 33.02,41.91 34.29,43.18 E21.10
N$11
  Bottom 0.381: E24.11 19.05,45.72 20.32,46.99 31.11,46.99 32.38,48.26 34.29,48.26 E21.12
N$12
  Top 0.381: E20.1 27.3,26.04 26.04,27.3 26.04,53.98 26.67,54.61 33.02,54.61 33.02,53.34 34.92,51.44 E21.13
  Bottom 0.381: E24.10 19.05,43.18 20.32,44.45 29.84,44.45 32.38,46.99 36.83,46.99 37.47,47.62 37.47,50.16 36.2,50.16 E21.13
N$13
  Bottom 0.381: E23.1 11.43,25.4 20.32,34.29 30.48,34.29 34.29,38.1 E21.8
N$14
  Bottom 0.381: E23.3 11.43,20.32 12.7,19.05 29.21,19.05 29.84,19.68 29.84,22.23 28.57,22.23 E20.2
N$15
  Top 0.381: E21.6 28.57,40.01 30.48,38.1 30.48,20.95 31.11,20.32 33.66,20.32 33.66,20.95 34.92,22.23 E20.13
  Bottom 0.381: E23.2 11.43,22.86 12.7,24.13 33.02,24.13 34.29,22.86 E20.13
N$16  (via drill 0.61)
  Top 0.381: v38.73,56.52 38.73,23.5 36.2,20.95 E20.12
  Bottom 0.381: v38.73,56.52 38.1,55.88 13.97,55.88 11.43,53.34 E24.1
N$17
  Bottom 0.381: E23.5 11.43,15.24 13.97,17.78 16.51,17.78 E23.11
N$18
  Top 0.381: E18.5 45.09,43.81 43.81,45.09 43.81,51.44 45.09,52.7 E18.1
N$19
  Top 0.381: R1.1 40.64,36.2 40.64,37.47 C18.1 41.27,38.1 44.45,38.1 E18.7
N$20
  Top 0.381: E18.15 53.98,51.44 60.33,57.78 C17.+
  Bottom 0.381: R2.2 58.42,60.33 59.69,59.05 60.33,59.05 C17.+
N$21
  Bottom 0.381: C18.2 41.27,43.18 43.81,40.64 44.45,40.64 E18.6
N$22
  Top 0.381: E18.14 54.61,48.26 60.33,42.55 C17.-
N$23
  Bottom 0.381: E6.12 196.85,38.1 214.63,38.1 219.71,43.18 E2.3
N$24
  Top 0.381: E18.4 46.35,45.09 52.7,38.73 E18.10
N$25
  Bottom 0.381: E6.11 196.85,35.56 198.12,36.83 217.17,36.83 219.71,39.37 226.06,39.37 227.33,40.64 E2.11
N$26
  Bottom 0.381: E6.10 196.85,33.02 198.12,34.29 226.06,34.29 227.33,33.02 E2.8
N$27  (via drill 0.61)
  Top 0.381: v114.94,46.99 116.84,48.9 v116.84,49.53 | v123.83,50.8 124.46,51.44 v124.46,53.34 | v157.48,50.8 157.48,48.9 E10.1
  Bottom 0.381: v114.94,46.99 58.42,46.99 54.61,43.18 E18.12 | v116.84,49.53 118.11,50.8 v123.83,50.8 | v124.46,53.34 141.6,53.34 144.15,50.8 v157.48,50.8
N$28  (via drill 0.61)
  Top 0.381: v109.86,44.45 109.86,48.9 110.49,49.53 110.49,83.82 111.76,85.09 E15.7
  Bottom 0.381: v109.86,44.45 118.11,44.45 120.65,41.91 124.46,41.91 125.73,40.64 128.27,40.64 E16.13
N$29  (via drill 0.61)
  Top 0.381: v135.25,48.9 132.72,51.44 v132.72,57.15 | v116.84,58.42 115.57,59.69 115.57,83.82 114.3,85.09 E15.6
  Bottom 0.381: v135.25,48.9 135.25,41.27 134.62,40.64 133.35,40.64 130.81,38.1 E16.12 | v132.72,57.15 131.44,58.42 v116.84,58.42
N$30  (via drill 0.61)
  Top 0.381: v124.46,74.3 124.46,75.56 127,75.56 128.27,74.3 128.27,55.24 131.44,52.07 131.44,37.47 130.18,36.2 E16.11
  Bottom 0.381: v124.46,74.3 114.94,74.3 112.39,71.75 E15.4
N$31  (via drill 0.61)
  Top 0.381: v127,50.16 127,35.56 128.91,33.66 E16.10 | v109.22,52.07 106.68,54.61 106.68,69.85 E15.2
  Bottom 0.381: v127,50.16 125.09,52.07 v109.22,52.07
N$32  (via drill 0.61)
  Top 0.381: v119.38,53.34 123.83,48.9 123.83,37.47 127,34.29 127,33.02 128.91,31.11 E16.9 | v106.05,53.34 104.14,55.24 104.14,69.85 E15.1
  Bottom 0.381: v106.05,53.34 v119.38,53.34
N$33  (via drill 0.61)
  Top 0.381: v125.73,45.72 125.73,67.31 123.19,69.85 v123.19,83.19
  Bottom 0.381: v125.73,45.72 128.27,45.72 E16.15 | v123.19,83.19 109.86,83.19 107.31,85.72 E15.9
N$34  (via drill 0.61)
  Top 0.381: v118.11,46.99 118.11,88.27 106.05,88.27 104.78,87 E15.10
  Bottom 0.381: v118.11,46.99 123.19,46.99 124.46,45.72 124.46,44.45 127,44.45 128.27,43.18 E16.14
N$35
  Top 0.381: E19.12 53.98,78.11 78.11,53.98 92.71,53.98 92.71,64.14 93.98,65.41 R37.2 93.98,66.67 93.98,67.94 R24.2
N$36
  Top 0.381: R36.2 88.9,66.67 88.9,67.94 R25.2
  Bottom 0.381: E19.10 54.61,73.66 75.56,73.66 80.01,69.22 80.01,67.94 80.64,67.31 87,67.31 88.27,68.58 R25.2
N$37
  Top 0.381: E25.9 18.41,71.75 26.04,79.38 26.04,81.92 26.67,82.55 34.92,82.55 34.92,81.92 E22.15
N$38
  Top 0.381: D3.A 241.3,47.62 241.3,45.72 229.87,34.29 226.06,34.29 226.06,23.5 R39.2
N$39
  Bottom 0.381: E25.1 11.43,83.82 16.51,78.74 E25.12
N$40
  Top 0.381: R26.2 83.82,67.94 83.82,66.67 R35.2
  Bottom 0.381: E19.8 54.61,68.58 55.88,67.31 79.38,67.31 80.64,66.04 83.19,66.04 R35.2
N$41
  Bottom 0.381: E22.1 29.21,83.82 30.48,82.55 50.8,82.55 52.07,81.28 E19.13
N$42  (via drill 0.61)
  Top 0.381: v31.75,78.74 29.21,81.28 E22.2
  Bottom 0.381: v31.75,78.74 33.02,77.47 50.8,77.47 52.07,76.2 E19.11
N$43  (via drill 0.61)
  Top 0.381: v31.11,76.2 31.11,76.83 29.21,78.74 E22.3
  Bottom 0.381: v31.11,76.2 32.38,74.93 46.99,74.93 50.8,71.12 52.07,71.12 E19.9
N$44
  Bottom 0.381: E22.4 26.67,76.2 25.4,74.93 16.51,74.93 15.88,75.56 15.88,77.47 19.05,77.47 21.59,80.01 43.18,80.01 44.45,78.74 E19.3
N$45
  Bottom 0.381: E22.5 29.21,73.66 30.48,72.39 43.18,72.39 44.45,73.66 E19.5
N$46
  Top 0.381: R34.2 78.74,66.67 78.74,67.94 R27.2
  Bottom 0.381: E19.4 46.99,76.2 50.8,72.39 74.3,72.39 78.11,68.58 R27.2
N$47
  Top 0.381: Q1.1 109.22,61.59 109.22,69.85 E15.3 109.22,72.39 109.22,85.09 E15.8
N$48  (via drill 0.61)
  Top 0.381: v161.29,74.3 161.29,65.41 162.56,64.14 Q2.3 | v96.52,76.83 96.52,69.22 R29.2
  Bottom 0.381: v161.29,74.3 160.02,75.56 140.34,75.56 137.79,78.11 97.79,78.11 v96.52,76.83
N$49  (via drill 0.61)
  Top 0.381: v142.24,64.14 138.43,67.94 v138.43,75.56 | v104.78,76.83 100.97,80.64 93.98,80.64 92.71,79.38 92.71,70.48 91.44,69.22 R30.2
  Bottom 0.381: v142.24,64.14 148.59,64.14 149.22,63.5 Q3.3 | v138.43,75.56 137.16,76.83 v104.78,76.83
N$50  (via drill 0.61)
  Top 0.381: v135.89,75.56 135.89,65.41 137.16,64.14 Q4.3 | v90.17,75.56 86.36,71.75 86.36,69.22 R31.2
  Bottom 0.381: v90.17,75.56 v135.89,75.56
N$51  (via drill 0.61)
  Top 0.381: v123.19,66.04 123.19,65.41 124.46,64.14 Q5.3
  Bottom 0.381: v123.19,66.04 122.56,66.67 100.33,66.67 97.16,69.85 83.19,69.85 81.92,68.58 R32.2
N$52  (via drill 0.61)
  Top 0.381: v79.38,63.5 76.2,66.67 76.2,67.94 R33.2
  Bottom 0.381: v79.38,63.5 111.12,63.5 Q1.3
N$53
  Bottom 0.381: Q1.2 111.12,60.96 107.31,57.15 75.56,57.15 74.3,55.88 R38.1
N$54  (via drill 0.61)
  Top 0.381: 205.74,82.55 205.74,85.09 E7.8 | 205.74,82.55 205.74,72.39 E7.3 | Q5.1 121.92,61.59 121.92,69.85 E14.3 121.92,72.39 v121.92,81.92 121.92,85.09 E14.8 | 205.74,82.55 v202.56,82.55
  Bottom 0.381: v202.56,82.55 124.46,82.55 123.83,81.92 v121.92,81.92
N$55
  Top 0.381: Q5.2 123.83,60.96 122.56,59.69 120.65,59.69 120.65,87.63 118.75,89.53 99.06,89.53 99.06,87 92.08,80.01 85.09,80.01 85.09,62.87 78.74,56.52 R34.1
N$56  (via drill 0.61)
  Top 0.381: v137.79,57.15 137.79,59.69 137.16,60.33 Q4.2 | v116.84,55.88 114.94,53.98 v114.94,50.8
  Bottom 0.381: v137.79,57.15 136.53,55.88 v116.84,55.88 | v114.94,50.8 97.16,50.8 94.61,53.34 87,53.34 84.45,55.88 R35.1
N$57
  Bottom 0.381: Q3.2 149.22,60.96 147.96,62.23 114.94,62.23 108.58,55.88 95.89,55.88 94.61,54.61 90.81,54.61 89.53,55.88 R36.1
N$58  (via drill 0.61)
  Top 0.381: v163.83,78.11 163.83,62.87 162.56,61.59 Q2.2 | v100.33,79.38 97.79,76.83 97.79,60.33 93.98,56.52 R37.1
  Bottom 0.381: v163.83,78.11 139.06,78.11 137.79,79.38 v100.33,79.38
N$59
  Top 0.381: R38.2 73.66,66.67 73.66,67.94 R28.2
  Bottom 0.381: E19.6 46.99,71.12 48.26,69.85 71.75,69.85 73.03,68.58 R28.2
N$60  (via drill 0.61)
  Top 0.381: E5.8 218.44,85.09 218.44,72.39 E5.3 217.81,70.48 206.38,59.05 193.04,59.05 v193.04,58.42 | E12.8 134.62,85.09 134.62,72.39 E12.3 134.62,69.85 134.62,61.59 Q4.1 134.62,60.33 v136.53,58.42
  Bottom 0.381: v193.04,58.42 v136.53,58.42
N$61  (via drill 0.61)
  Top 0.381: E4.8 231.14,85.09 231.14,72.39 E4.3 230.5,70.48 224.79,64.77 224.79,62.87 v217.81,55.88 | E11.8 147.32,85.09 147.32,72.39 E11.3 147.32,69.85 147.32,61.59 Q3.1 147.32,60.33 147.32,57.78 v149.22,55.88
  Bottom 0.381: v217.81,55.88 v149.22,55.88
N$62  (via drill 0.61)
  Top 0.381: E3.3 243.84,72.39 243.84,85.09 E3.8 | Q2.1 160.02,61.59 160.02,69.85 E9.3 160.02,72.39 v160.02,79.38 160.02,85.09 E9.8
  Bottom 0.381: v160.02,79.38 164.47,79.38 165.1,80.01 234.95,80.01 243.21,71.75 E3.3
N$63
  Top 0.381: D6.A 210.82,47.62 210.82,32.38 215.26,27.94 215.26,26.04 217.17,24.13 223.52,24.13 223.52,23.5 R40.2
N$64
  Top 0.381: D2.A 240.66,30.48 239.4,31.75 228.6,31.75 228.6,23.5 R41.2
N$65
  Bottom 0.381: D5.A 211.46,30.48 214,27.94 217.17,27.94 220.98,24.13 220.98,23.5 R42.2
N$66  (via drill 0.61)
  Top 0.381: v179.07,27.3 179.07,28.57 177.8,29.84 D7.A
  Bottom 0.381: v179.07,27.3 182.88,23.5 R43.2
N$67
  Top 0.381: D1.A 240.66,12.7 238.12,15.24 231.14,15.24 231.14,22.23 R44.2
N$68
  Top 0.381: D4.A 210.82,13.34 218.44,20.95 218.44,22.23 R45.2
N$69
  Top 0.381: D8.A 177.8,47.62 176.53,46.35 176.53,23.5 178.44,21.59 184.78,21.59 184.78,22.86 R46.2
N$70  (via drill 0.61)
  Top 0.381: v50.16,66.04 50.16,76.83 46.35,80.64 E19.2 | v172.72,60.96 175.26,58.42 175.26,48.9 D8.K
  Bottom 0.381: v50.16,66.04 51.44,64.77 140.97,64.77 141.6,65.41 167.64,65.41 172.09,60.96 v172.72,60.96
N$71  (via drill 0.61)
  Top 0.381: v102.23,44.45 102.23,46.35 103.5,47.62 E17.1 | v200.66,29.21 208.28,21.59 208.28,13.34 D4.K
  Bottom 0.381: v102.23,44.45 102.23,31.75 113.67,31.75 116.2,29.21 125.09,29.21 127.64,26.67 160.66,26.67 163.19,29.21 v200.66,29.21
N$72  (via drill 0.61)
  Top 0.381: v167.64,33.02 167.64,10.16 184.78,10.16 187.32,7.62 187.32,6.99 232.41,6.99 238.12,12.7 D1.K
  Bottom 0.381: v167.64,33.02 166.37,34.29 143.51,34.29 140.97,36.83 125.73,36.83 123.19,39.37 116.84,39.37 114.3,41.91 110.49,41.91 106.68,45.72 105.41,45.72 E17.2
N$73  (via drill 0.61)
  Top 0.381: v109.22,22.86 109.22,38.1 104.78,42.55 E17.3 | v173.99,27.94 175.26,29.21 175.26,29.84 D7.K
  Bottom 0.381: v109.22,22.86 158.12,22.86 163.19,27.94 v173.99,27.94
N$74  (via drill 0.61)
  Top 0.381: v107.95,80.64 107.95,78.11 99.06,69.22 99.06,45.72 103.5,41.27 E17.4 | v138.43,80.64 143.51,75.56 v143.51,53.34 | v200.66,52.07 208.28,44.45 208.28,31.11 D5.K
  Bottom 0.381: v107.95,80.64 v138.43,80.64 | v143.51,53.34 144.78,52.07 v200.66,52.07
N$75  (via drill 0.61)
  Top 0.381: v232.41,16.51 232.41,23.5 238.76,29.84 D2.K | v157.48,15.88 154.31,19.05 v154.31,24.13 | v107.95,24.13 107.95,36.2 106.05,38.1 105.41,38.1 E17.5
  Bottom 0.381: v232.41,16.51 231.78,15.88 v157.48,15.88 | v154.31,24.13 v107.95,24.13
N$76  (via drill 0.61)
  Top 0.381: v97.79,52.07 97.79,41.91 103.5,36.2 E17.6 | v205.74,54.61 208.28,52.07 208.28,48.9 D6.K
  Bottom 0.381: v97.79,52.07 100.33,54.61 v205.74,54.61
N$77  (via drill 0.61)
  Top 0.381: v113.67,57.15 v113.67,34.29 | v231.14,59.69 238.76,52.07 238.76,48.9 D3.K
  Bottom 0.381: v113.67,34.29 106.68,34.29 105.41,33.02 E17.7 | v113.67,57.15 116.2,59.69 v231.14,59.69
NUM
  Bottom 0.381: E20.10 36.83,15.24 101.6,15.24 103.5,13.34 114.94,13.34 116.2,14.61 J2.11
RUN
  Top 0.381: E2.1 220.98,48.9 220.98,52.7 R9.2 | RUN.1 376.56,6.35 376.56,16.51 RUN.2
  Bottom 0.381: R9.2 221.62,53.34 224.16,55.88 280.67,55.88 281.94,54.61 342.26,54.61 356.24,40.64 356.24,22.86 371.48,22.86 375.29,19.05 RUN.2
SHLT\  (via drill 0.61)
  Top 0.381: SHLT\.1 353.69,6.35 353.69,16.51 SHLT\.2 | v143.51,17.14 143.51,10.16 142.24,8.89 J1.5 | v216.53,26.67 218.44,28.57 218.44,45.72 | 218.44,45.72 218.44,52.7 R19.2 | 218.44,45.72 219.71,45.72 E2.2
  Bottom 0.381: v143.51,17.14 146.69,20.32 194.94,20.32 196.85,22.23 | 196.85,22.23 196.85,26.67 v216.53,26.67 | 196.85,22.23 200.03,19.05 250.82,19.05 252.09,20.32 351.15,20.32 352.43,19.05 SHLT\.2
STHIS\  (via drill 0.61)
  Top 0.381: v177.8,8.89 177.8,2.54 143.51,2.54 139.7,6.35 J1.4 | v214,11.43 224.79,22.23 224.79,31.75 221.62,34.92 E2.6
  Bottom 0.381: v177.8,8.89 180.34,11.43 v214,11.43
VCC  (via drill 0.61)
  Top 0.381: R45.1 219.07,12.7 220.34,12.7 R42.1 221.62,12.7 222.88,12.7 R40.1 224.16,12.7 225.43,12.7 R39.1 | C2.1 227.33,29.84 227.33,14.61 226.06,13.34 R39.1 | R39.1 226.69,12.7 227.97,12.7 R41.1 229.24,12.7 230.5,12.7 R44.1 | R18.1 247.01,12.7 248.28,12.7 R17.1 249.56,12.7 250.82,12.7 R16.1 252.09,12.7 253.37,12.7 R15.1 254.63,12.7 255.91,12.7 R14.1 | C1.1 257.81,27.3 257.81,14.61 256.54,13.34 R14.1 | R14.1 257.18,12.7 258.44,12.7 R13.1 259.71,12.7 260.99,12.7 R11.1 262.25,12.7 263.52,12.7 R12.1 | R43.1 183.51,12.7 184.78,12.7 R46.1 186.06,12.7 187.32,12.7 R3.1 188.59,12.7 189.87,12.7 R5.1 191.13,12.7 192.41,12.7 R7.1 | C3.1 194.31,27.3 194.31,14.61 193.04,13.34 R7.1 | R7.1 193.68,12.7 194.94,12.7 R6.1 196.22,12.7 197.49,12.7 R8.1 | E16.5 121.28,38.73 121.28,40.01 E16.4 121.28,41.27 121.28,42.55 E16.3 | v114.3,28.57 116.2,30.48 R4.1 | C7.1 128.27,27.3 131.44,24.13 131.44,15.88 J1.16 | R10.1 160.02,13.34 163.83,17.14 163.83,29.84 C5.1 | E8.3 174.62,75.56 174.62,74.3 E8.4 174.62,73.03 174.62,71.75 E8.5 175.9,70.48 177.16,69.22 177.16,66.04 181.61,61.59 C4.1 | v179.71,76.2 179.71,78.11 182.25,80.64 E8.16 | R19.1 219.07,63.5 220.34,63.5 R9.1 221.62,63.5 222.88,63.5 R22.1 | E2.14 229.24,48.9 229.87,49.53 229.87,61.59 228.6,62.87 R20.1 229.24,63.5 230.5,63.5 R21.1 | E24.5 9.53,43.81 9.53,45.09 E24.4 9.53,46.35 9.53,47.62 E24.3 9.53,48.9 9.53,50.16 E24.2 | E24.14 17.14,53.98 17.14,64.77 16.51,65.41 C16.1 15.88,66.04 14.61,67.31 14.61,69.22 10.79,73.03 E25.5 | C12.1 34.29,34.92 34.92,34.29 34.92,26.04 E20.14 | C9.1 51.44,33.02 43.81,25.4 41.27,25.4 R1.2
  Top 0.381: E24.8 17.14,37.47 17.14,36.83 16.51,36.2 C15.1 16.51,34.92 17.14,34.29 17.14,26.04 E23.14 17.14,24.77 15.88,23.5 15.88,18.41 | 15.88,13.34 15.88,8.89 16.51,8.26 C14.1 | 15.88,13.34 17.14,14.61 E23.10 | 13.34,15.88 15.88,13.34 | 13.34,15.88 11.43,17.78 E23.4 | 15.88,18.41 13.34,15.88 | 15.88,18.41 17.14,19.68 E23.12 | E13.5 139.06,38.73 139.06,40.01 E13.4 139.06,41.27 139.06,42.55 E13.3 | C20.+ 85.09,50.16 92.71,50.16 C19.+ 94.61,49.53 96.52,47.62 96.52,24.13 104.14,16.51 J2.16 | R28.1 74.3,78.74 75.56,78.74 R33.1 76.83,78.74 78.11,78.74 R27.1 79.38,78.74 80.64,78.74 R32.1 81.92,78.74 83.19,78.74 R26.1 | R31.1 87,78.74 88.27,78.74 R25.1 89.53,78.74 90.81,78.74 R30.1 | R29.1 95.89,78.74 94.61,78.74 R24.1 | E21.14 34.92,53.98 34.29,54.61 34.29,62.87 C13.1 | E18.16 52.7,53.98 52.7,55.88 48.26,60.33 R2.1 48.26,61.59 52.07,65.41 C10.1 51.44,66.04 51.44,81.92 52.7,83.19 E19.14
  Bottom 0.381: R44.1 231.78,12.7 233.04,13.97 244.47,13.97 245.75,12.7 R18.1 | v114.3,28.57 111.76,28.57 111.12,27.94 C8.1 | 118.11,34.29 116.84,33.02 116.84,31.11 R4.1 | 118.11,34.29 121.28,37.47 E16.5 | J2.16 104.78,15.88 106.05,17.14 130.18,17.14 131.44,15.88 J1.16 | C5.1 163.19,30.48 160.66,27.94 146.69,27.94 C6.1 145.41,27.94 144.15,29.21 130.18,29.21 128.91,27.94 C7.1 127.64,27.94 123.83,31.75 120.65,31.75 118.11,34.29 | R43.1 182.25,12.7 160.66,12.7 R10.1 | R45.1 217.81,12.7 216.53,13.97 200.03,13.97 198.75,12.7 R8.1 | v179.71,76.2 176.53,76.2 E8.3 | R22.1 224.16,63.5 225.43,63.5 R23.1 226.69,63.5 227.97,63.5 R20.1 | E1.16 257.81,48.26 256.54,49.53 231.14,49.53 229.87,48.26 E2.14 227.33,48.26 226.06,49.53 193.04,49.53 | C4.1 182.25,60.96 183.51,62.23 216.53,62.23 217.81,63.5 R19.1 | E24.2 11.43,50.8 13.97,50.8 16.51,53.34 E24.14 19.05,53.34 20.32,52.07 38.1,52.07 | R1.2 40.01,25.4 36.83,25.4 E20.14 34.29,25.4 33.02,26.67 20.32,26.67 19.05,25.4 E23.14 | C11.1 33.66,7.62 32.38,8.89 18.41,8.89 17.14,7.62 C14.1 | E24.5 10.79,42.55 15.24,38.1 16.51,38.1 E24.8 | 144.15,49.53 145.41,48.26 | 144.15,49.53 143.51,50.16 132.72,50.16 130.81,48.26 E16.16 128.27,48.26 127.64,48.9 123.83,48.9 123.19,49.53 118.75,49.53 117.47,48.26 113.03,48.26 E17.16 110.49,48.26 109.22,49.53 94.61,49.53 C19.+ | 145.41,48.26 146.05,48.26 E13.16 | 162.56,49.53 163.83,48.26 E10.14 | 162.56,49.53 144.15,49.53 | 193.04,49.53 194.31,48.26 E6.16 | 193.04,49.53 162.56,49.53 | 145.41,48.26 144.78,48.26 140.34,43.81 E13.3 | R31.1 85.72,78.74 84.45,78.74 R26.1 | R24.1 93.34,78.74 92.08,78.74 R30.1 | E22.16 36.83,83.82 38.1,85.09 50.8,85.09 52.07,83.82 E19.14 54.61,83.82 67.94,83.82 73.03,78.74 R28.1
  Bottom 0.381: 38.1,52.07 41.91,48.26 44.45,48.26 E18.3 46.99,48.26 52.07,53.34 E18.16 54.61,53.34 80.64,53.34 82.55,51.44 C20.+ | 38.1,52.07 36.83,53.34 E21.14